# Altium schematic sheet BuckConverter.SchDoc
size A; SheetNumber: 10; SheetTotal: 11
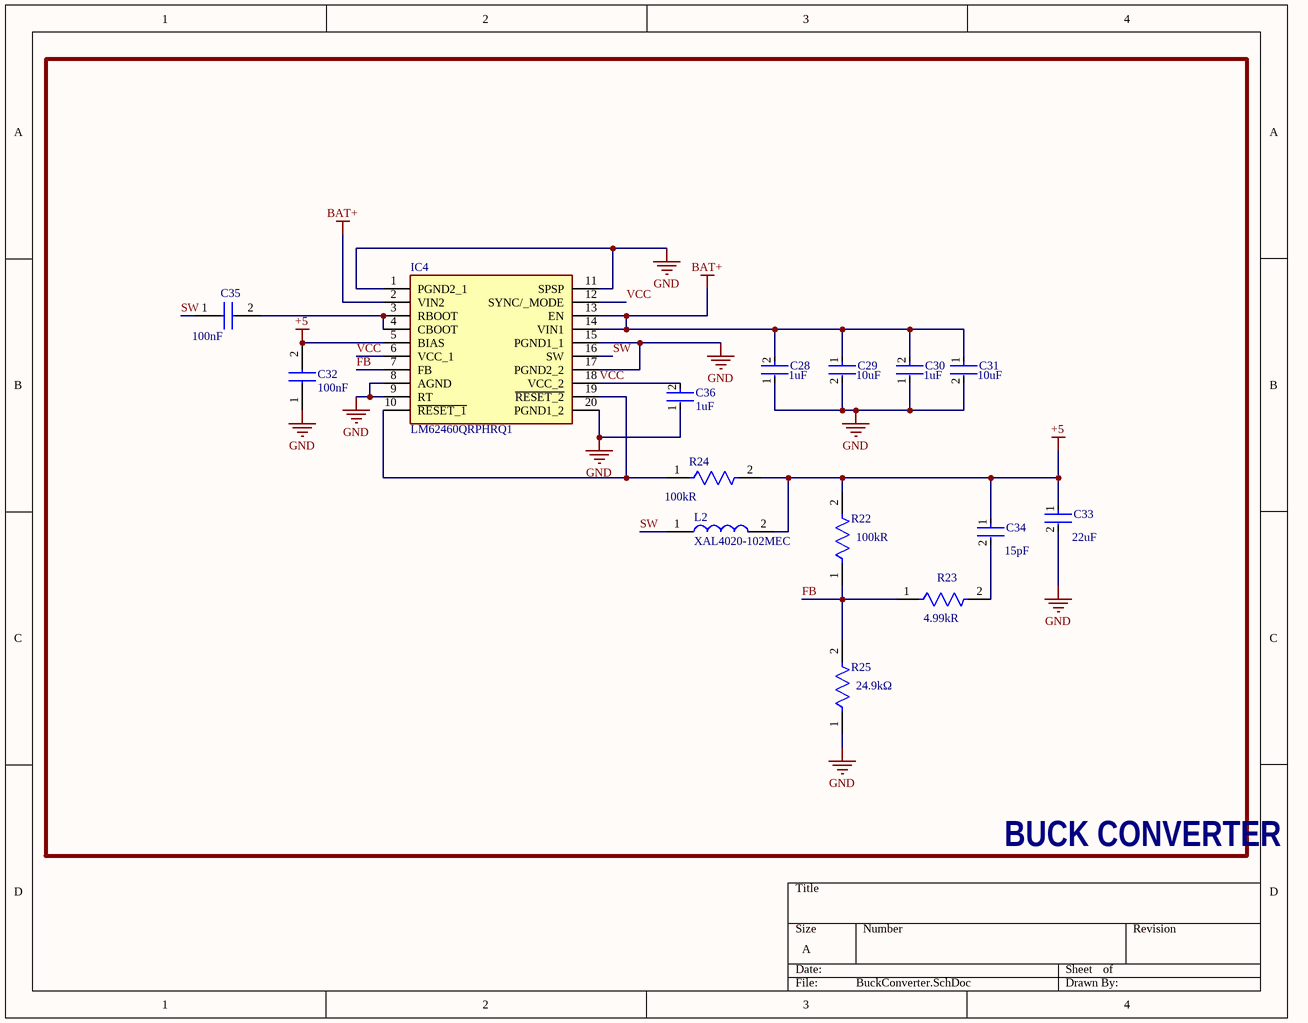
[diagram p0: BuckConverter.SchDoc]

## Parts
C28  Capacitance: 1uF  [FP-C1608-080-0_1-IPC_B]  (hidden comment: C1608X5R1H105K080AB)
C29  Capacitance: 10uF  [FP-GRM32-MFG]  (hidden comment: GRM32ER71H106KA12L)
C30  Capacitance: 1uF  [FP-C1608-080-0_1-IPC_B]  (hidden comment: C1608X5R1H105K080AB)
C31  Capacitance: 10uF  [FP-GRM32-MFG]  (hidden comment: GRM32ER71H106KA12L)
C32  capacitance: 100nF  [CAPC1005X55N]  (hidden comment: GRM155R71A104KA01D)
C33  Capacitance: 22uF  [FP-GRM21B-0_2-e0_2_0_7-IPC_C]  (hidden comment: GRM21BR61A226ME44L)
C34  Capacitance: 15pF  [FP-CGA1A-0_1-0_03-IPC_C]  (hidden comment: CGA1A2C0G1E150J030BA)
C35  capacitance: 100nF  [CAPC1005X55N]  (hidden comment: GRM155R71A104KA01D)
C36  Capacitance: 1uF  [FP-GRM188-0_1-MFG]  (hidden comment: GRM188R60J105KA01D)
IC4  LM62460QRPHRQ1  [LM62460QRPHRQ1]
L2  XAL4020-102MEC  [XAL40XX]
R22  Resistance: 100kR  [FP-CRCW0402-e3-IPC_C]  (hidden comment: CRCW0402100KFKED)
R23  Resistance: 4.99kR  [FP-CRCW0402-e3-MFG]  (hidden comment: CRCW04024K99FKED)
R24  Resistance: 100kR  [FP-CRCW0402-e3-IPC_C]  (hidden comment: CRCW0402100KFKED)
R25  Resistance: 24.9kΩ  [FP-RC_L0603-MFG]  (hidden comment: RC0603FR-0724K9L)

## Blocks framed on the sheet
BUCK CONVERTER: C28-C36 IC4 L2 R22-R25

## Nets
+5: C32.2 C33.1 C34.1 IC4.5(BIAS) L2.2 R22.2 R24.2
BAT+: C28.2 C29.1 C30.2 C31.1 IC4.2(VIN2) IC4.13(EN) IC4.14(VIN1)
GND: C28.1 C29.2 C30.1 C31.2 C32.1 C33.2 C36.1 IC4.1(PGND2_1) IC4.8(AGND) IC4.9(RT) IC4.11(SPSP) IC4.15(PGND1_1) IC4.17(PGND2_2) IC4.20(PGND1_2) R25.1
FB: IC4.7(FB) R22.1 R23.1 R25.2
SW: C35.1 IC4.16(SW) L2.1
VCC: C36.2 IC4.6(VCC_1) IC4.12(SYNC/_MODE) IC4.18(VCC_2)
NetC34_2: C34.2 R23.2
NetC35_2: C35.2 IC4.3(RBOOT) IC4.4(CBOOT)
NetIC4_10: IC4.10(~{RESET_1}) IC4.19(~{RESET_2}) R24.1

## Library data of the parts
C28 C30 = CMP-2000-06025-2: Multilayer Ceramic Capacitors 1μF ±10% 50V X5R SMD 0603; Lead Free: Lead Free; Height: 0.8mm; Mount: Surface Mount; Radiation Hardening: No; Thickness: 0.035inch; Length: 1.6mm; Max Operating Temperature: 85°C; REACH SVHC: No SVHC; Min Operating Temperature: -55°C; Construction: Flat; RoHS Compliant: Yes; Voltage Rating: 50V; Dielectric: X5R; Packaging: Tape and Reel; Termination: SMD/SMT; Voltage Rating (DC): 50V; Case Code (Imperial): 0603; Voltage: 50V; Width: 0.031inch; Weight: 7.1E-05oz; Depth: 0.8mm; Case Code (Metric): 1608; Series: C; Case/Package: 0603; Tolerance: 10%; Resistor Type: Ceramic; Number of Pins: 2; Dielectric Material: Ceramic; Package Quantity: 1
C29 C31 = CMP-2000-05261-2: CAP CER 10UF 50V X7R 1210; Manufacturer: Murata; Tolerance: 10%; Material: Ceramic; Temperature Coefficient: 15%; Voltage Rating: 50V; Temperature Characteristic: X7R; Value: 10uF; ComponentLink2Description: Datasheet; Device Class L1: Passive Components; Lead Free: Yes; Temperature Range High: +125°C; Category: Cap; Manufacturer Part Number: GRM32ER71H106KA12L; ComponentLink2URL: https://search.murata.co.jp/Ceramy/image/img/A01X/G101/ENG/GRM32ER71H106KA12-01.pdf; Device Class L2: Capacitors; Package: GRM32; Mouser Description: 1210 10 uF 50 V ±10% Tolerance X7R SMT Multilayer Ceramic Capacitor; Octopart: https://octopart.com/grm32er71h106ka12l-murata-10470987; Digikey Description: CAP CER 10UF 50V X7R 1210; Height: 2.7mm; Temperature: -55°C to +125°C; Temperature Range Low: -55°C; RoHS: TRUE; Device Class L3: Ceramic Capacitors; Automotive: No
C32 C35 = GRM155R71A104KA01D: Capacitor; Manufacturer_Name: Murata Electronics; Datasheet Link: http://www.murata.com/~/media/webrenewal/support/library/catalog/products/capacitor/mlcc/c02e.pdf; Height: 0.55mm; Manufacturer_Part_Number: GRM155R71A104KA01D; Mouser Part Number: 81-GRM155R71A104KA1D; Mouser Price/Stock: https://www.mouser.co.uk/ProductDetail/Murata-Electronics/GRM155R71A104KA01D?qs=8YPuuxuUzMIpJ%252BESZ%2Fj8CQ%3D%3D; Arrow Part Number: GRM155R71A104KA01D; Arrow Price/Stock: https://www.arrow.com/en/products/grm155r71a104ka01d/murata-manufacturing?region=nac
C33 = CMP-06035-039918-1: Chip Multilayer Ceramic Capacitors for General Purpose, 0805, 22uF, X5R, 15%, 20%, 10V; Dissipation Factor: 0.035%; Min Operating Temperature: -55°C; Voltage Rating (DC): 10V; Height: 1.25mm; Depth: 1.25mm; Max Operating Temperature: 85°C; Width: 1.25mm; Lead Free: Lead Free; Dielectric Material: Ceramic; Weight: 0.000335oz; Tolerance: 20%; Voltage Rating: 10V; Case Code (Metric): 2012; Termination: SMD/SMT; Length: 2mm; Thickness: 0.057inch; Case/Package: 0805; Packaging: Tape and Reel; Voltage: 10V; Case Code (Imperial): 0805; Resistor Type: Ceramic; Package Quantity: 3000; Mount: Surface Mount; Dielectric: X5R
C34 = CMP-08246-001148-1: Cap Ceramic 15pF 25V C0G 5% Pad SMD 0201 125°C Automotive T/R; Packaging: Tape and Reel; Max Operating Temperature: 125°C; Tolerance: 5%; Composition: Ceramic; Ratings: AEC-Q200; Voltage Rating (DC): 25V; Case Code (Imperial): 0201; Min Operating Temperature: -55°C; Thickness: 0.013inch; Width: 0.012inch; Depth: 0.3mm; Case Code (Metric): 0603; Case/Package: 0201; Termination: SMD/SMT; Weight: 6E-06oz; Mount: Surface Mount; Package Quantity: 1; Voltage Rating: 25V; Dielectric: C0G; Length: 0.6mm; Height: 0.3mm
C36 = CMP-2006-02790-2: CAP CER 1UF 6.3V X5R 0603; Insulation Resistance: 500MR; Tolerance: 10%; Dielectric Material: Ceramic; Thickness: 0.035inch; Depth: 0.8mm; Min Operating Temperature: -55°C; Mount: Surface Mount; Voltage Rating (DC): 6.3V; Case/Package: 0603; Voltage Rating: 6.3V; Voltage: 6.3V; Max Operating Temperature: 85°C; Case Code (Imperial): 0603; Dielectric: X5R; Packaging: Tape and Reel; Height: 0.8mm; Case Code (Metric): 1608; Radiation Hardening: No; REACH SVHC: No SVHC; Width: 0.031inch; Package Quantity: 1; Lead Free: Lead Free; Length: 1.6mm; Termination: SMD/SMT
IC4 = LM62460QRPHRQ1: Integrated Circuit; Manufacturer_Name: Texas Instruments; Datasheet Link: https://www.ti.com/product/LM62460-Q1?HQS=TI-null-null-octopart-df-pf-null-wwe; Height: 1mm; Manufacturer_Part_Number: LM62460QRPHRQ1; Mouser Part Number: 595-LM62460QRPHRQ1; Mouser Price/Stock: https://www.mouser.co.uk/ProductDetail/Texas-Instruments/LM62460QRPHRQ1?qs=QNEnbhJQKvYn1QEWk8lAhA%3D%3D; Arrow Part Number: LM62460QRPHRQ1; Arrow Price/Stock: https://www.arrow.com/en/products/lm62460qrphrq1/texas-instruments?region=nac
L2 = XAL4020-102MEC: Inductor; Manufacturer_Name: COILCRAFT; Datasheet Link: https://www.coilcraft.com/pdfs/xal4000.pdf; Manufacturer_Part_Number: XAL4020-102MEC; Mouser Part Number: 994-XAL4020-102MEC; Mouser Price/Stock: https://www.mouser.co.uk/ProductDetail/Coilcraft/XAL4020-102MEC?qs=zCSbvcPd3pbLq0M7ZKfPRA%3D%3D
R22 R24 = CMP-2002-08123-3: RES Thick Film, 100kΩ, 1%, 0.063W, 100ppm/°C, 0402; Power Rating: 63mW; Voltage Rating (DC): 50V; Lead Free: Lead Free; Height: 0.35mm; Contact Plating: Tin; Min Operating Temperature: -55°C; Package Quantity: 10000; Case/Package: 0402; Temperature Coefficient: 100ppm/°C; Number of Terminations: 2; Packaging: Tape and Reel; Max Power Dissipation: 63mW; Case Code (Metric): 1005; Mount: Surface Mount; Width: 0.02inch; Termination: SMD/SMT; Length: 1mm; Number of Pins: 2; Weight: 2.3E-05oz; Radiation Hardening: No; Tolerance: 1%; Military Standard: Not; Features: Automotive AEC-Q200; Depth: 0.5mm; Composition: Thick Film; Max Operating Temperature: 155°C; Voltage Rating: 50V; Case Code (Imperial): 0402
R23 = CMP-2002-00057-2: RES Thick Film, 4.99kΩ, 1%, 0.063W, 100ppm/°C, 0402; Power Rating: 63mW; Voltage Rating: 50V; Package Quantity: 10; Max Power Dissipation: 63mW; Temperature Coefficient: 100ppm/°C; Lead Free: Lead Free; Mount: Surface Mount; Height: 0.35mm; Number of Terminations: 2; Contact Plating: Tin; Case/Package: 0402; Max Operating Temperature: 155°C; Case Code (Imperial): 0402; Weight: 2.3E-05oz; Width: 0.5mm; Features: Automotive AEC-Q200; Voltage Rating (DC): 50V; Tolerance: 1%; Min Operating Temperature: -55°C; Length: 1mm; Depth: 0.5mm; Military Standard: Not; Packaging: Tape and Reel; Radiation Hardening: No; Composition: Thick Film; Termination: SMD/SMT; Case Code (Metric): 1005
R25 = CMP-03412-013083-1: RES SMD 24.9K OHM 1% 1/10W 0603; Manufacturer: Yageo; Approved Alternate Part Number: 541-1.00HHCT-ND; Voltage Rating: 75V; Power Rating: 0.1W; Value: 24.9kΩ; Power: 100mW; Temperature Coefficient: 100ppm/°C; Footprint Url: https://www.yageo.com/upload/website/yageo_PYu-R_Mount_10_19050818_343.pdf; Automotive: No; Temperature Range Low: -55°C; Manufacturer Part Number: RC0603FR-0724K9L; Ipc Land Pattern Name: RESC16080X45; Digikey Description: RES SMD 24.9K OHM 1% 1/10W 0603; Voltage: 75V; Composition: Thick Film; Device Class L1: Passive Components; Device Class L2: Resistors; Device Class L3: Chip SMD Resistors; ComponentLink2URL: https://www.yageo.com/upload/media/product/productsearch/datasheet/rchip/PYu-RC_Group_51_RoHS_L_10.pdf; Series: RC_L; Octopart: https://octopart.com/rc0603fr-0724k9l-yageo-1189838; RoHS: TRUE; Category: Res; Height: 0.55mm; Tolerance: 1%; Temperature: -55°C to +155°C; Temperature Range High: +155°C; ComponentLink2Description: Datasheet; Package: RC_L0603; Lead Free: Yes; Mouser Description: Res Thick Film 1.6 x 0.8 mm 24.9K Ohm 1% 0.1W(1/10W) 100ppm/ C Molded SMD Paper T/R